# Altium schematic sheet IO_ANALOG_DIGITAL.SchDoc
size A3; SheetNumber: 12; SheetTotal: 14
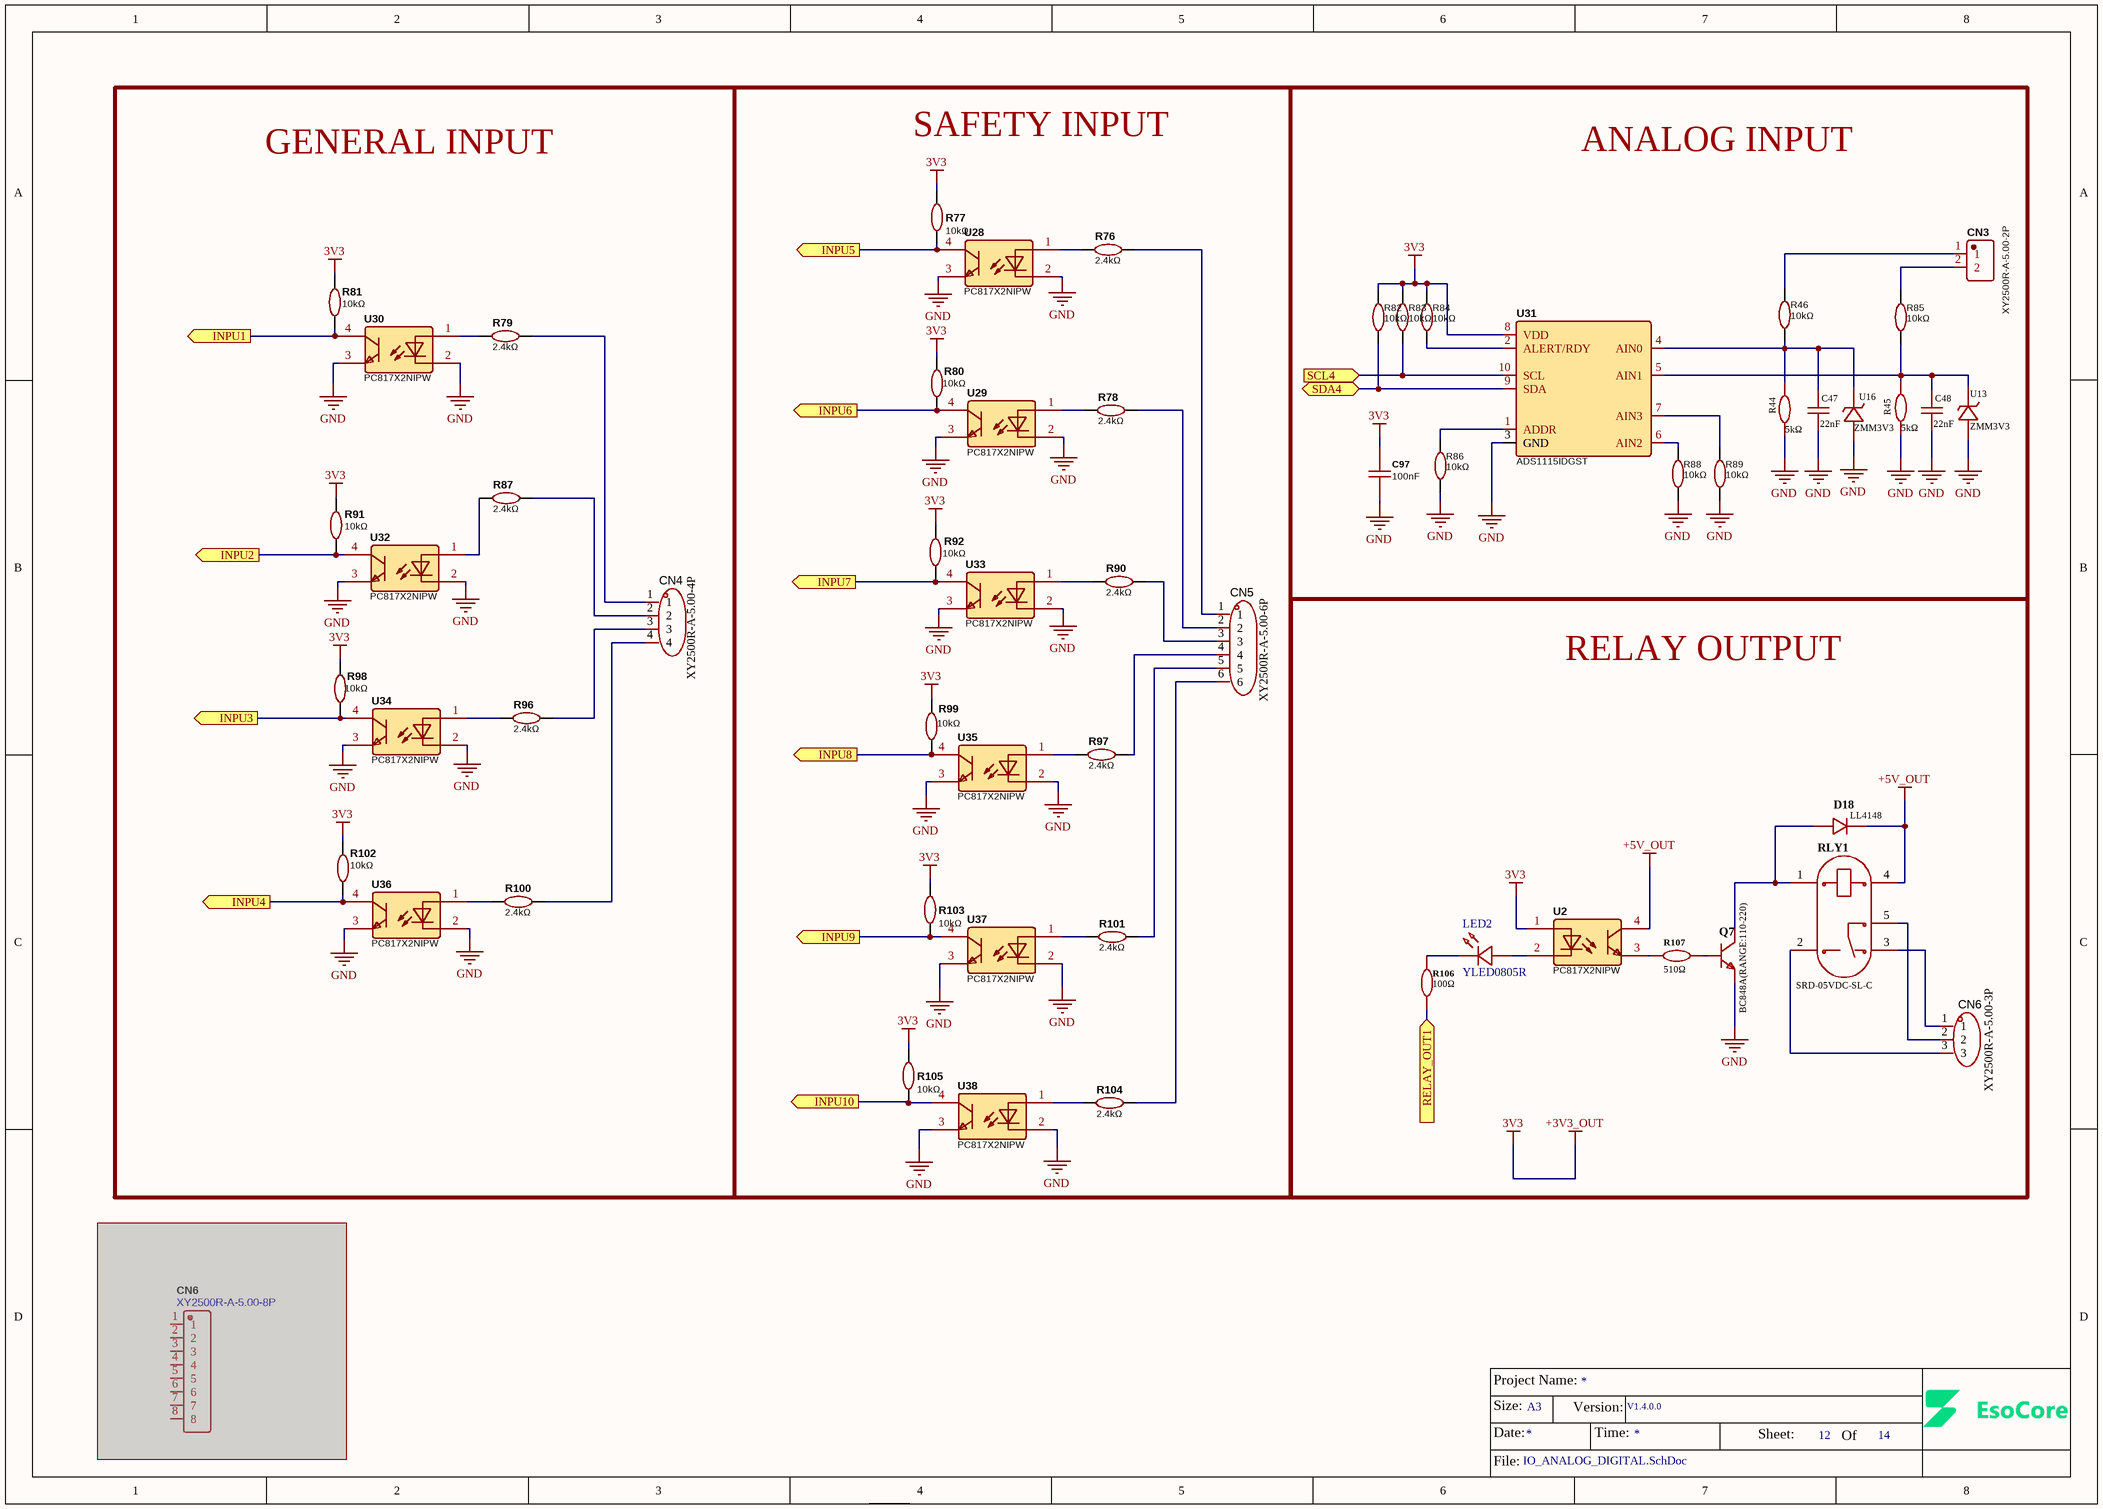
[diagram p0: IO_ANALOG_DIGITAL.SchDoc]

## Parts
(Parts that share a designator on the sheet are numbered #1, #2 ... from top to bottom, then left to right.)
C47  22nF  [C_0603]
C48  22nF  [C_0603]
C97  100nF  [C_0805]
CN3  XY2500R-A-5.00-2P  [CONN-TH_XY2500R-A-5.00-2P]
CN4  XY2500R-A-5.00-4P  [CONN-TH_XY2500R-A-5.00-4P]
CN5  XY2500R-A-5.00-6P  [CONN-TH_XY2500R-A-5.00-6P]
CN6#1  XY2500R-A-5.00-3P  [CONN-TH_XY2500R-A-5.00-3P]
CN6#2  XY2500R-A-5.00-8P  [CONN-TH_8P-P5.00_XY2500R-A-5.00-8P]  (masked out: inside a compile mask, not in the netlist)
D18  LL4148  [LL-34_L3.5-W1.5-RD]
LED2  YLED0805R  [LED0805-RD_RED]
Q7  BC848A(RANGE:110-220)  [SOT-23-3_L2.9-W1.6-P1.90-LS2.8-BR]
R44  5kΩ  [R_0603]
R45  5kΩ  [R_0603]
R46  10kΩ  [R_0603]
R76  2.4kΩ  [R_0603]
R77  10kΩ  [R_0805]
R78  2.4kΩ  [R_0603]
R79  2.4kΩ  [R_0603]
R80  10kΩ  [R_0805]
R81  10kΩ  [R_0805]
R82  10kΩ  [R_0603]
R83  10kΩ  [R_0603]
R84  10kΩ  [R_0603]
R85  10kΩ  [R_0603]
R86  10kΩ  [R_0603]
R87  2.4kΩ  [R_0603]
R88  10kΩ  [R_0603]
R89  10kΩ  [R_0603]
R90  2.4kΩ  [R_0603]
R91  10kΩ  [R_0805]
R92  10kΩ  [R_0805]
R96  2.4kΩ  [R_0603]
R97  2.4kΩ  [R_0603]
R98  10kΩ  [R_0805]
R99  10kΩ  [R_0805]
R100  2.4kΩ  [R_0603]
R101  2.4kΩ  [R_0603]
R102  10kΩ  [R_0805]
R103  10kΩ  [R_0805]
R104  2.4kΩ  [R_0603]
R105  10kΩ  [R_0805]
R106  100Ω  [R_0805]
R107  510Ω  [R_0805]
RLY1  SRD-05VDC-SL-C  [RELAY-TH_SRD-XXVDC-XL-C]
U2  PC817X2NIPW  [SOP-4_L6.5-W4.6-P2.54-LS10.0]
U13  ZMM3V3  [LL-34_L3.5-W1.5-RD]
U16  ZMM3V3  [LL-34_L3.5-W1.5-RD]
U28  PC817X2NIPW  [SOP-4_L6.5-W4.6-P2.54-LS10.0]
U29  PC817X2NIPW  [SOP-4_L6.5-W4.6-P2.54-LS10.0]
U30  PC817X2NIPW  [SOP-4_L6.5-W4.6-P2.54-LS10.0]
U31  ADS1115IDGST  [VSSOP-10_L3.0-W3.0-P0.50-LS4.9-BL]
U32  PC817X2NIPW  [SOP-4_L6.5-W4.6-P2.54-LS10.0]
U33  PC817X2NIPW  [SOP-4_L6.5-W4.6-P2.54-LS10.0]
U34  PC817X2NIPW  [SOP-4_L6.5-W4.6-P2.54-LS10.0]
U35  PC817X2NIPW  [SOP-4_L6.5-W4.6-P2.54-LS10.0]
U36  PC817X2NIPW  [SOP-4_L6.5-W4.6-P2.54-LS10.0]
U37  PC817X2NIPW  [SOP-4_L6.5-W4.6-P2.54-LS10.0]
U38  PC817X2NIPW  [SOP-4_L6.5-W4.6-P2.54-LS10.0]

## Blocks framed on the sheet
SAFETY INPUT: CN5 R76-R78 R80 R90 R92 R97 R99 R101 R103-R105 U28 U29 U33 U35 U37 U38
RELAY OUTPUT: CN6#1 D18 LED2 Q7 R106 R107 RLY1 U2

## Ports
INPU1 (out), INPU2 (out), INPU3 (out), INPU4 (out), INPU5 (out), INPU6 (out), INPU7 (out), INPU8 (out), INPU9 (out), INPU10 (out), RELAY_OUT1 (in), SCL4 (in), SDA4 (bidir)

## Nets
+3V3_OUT: C97.2 R77.2 R80.2 R81.2 R82.2 R83.2 R84.2 R91.2 R92.2 R98.2 R99.2 R102.2 R103.2 R105.2 U2.1(A) U31.8(VDD)  [also labelled 3V3]
+5V_OUT: D18.1(K) RLY1.4 U2.4(C)
GND: C47.1 C48.1 C97.1 Q7.2(E) R44.1 R45.1 R86.1 R88.1 R89.1 U13.2(A) U16.2(A) U28.2(C) U28.3(E) U29.2(C) U29.3(E) U30.2(C) U30.3(E) U31.3(GND) U32.2(C) U32.3(E) U33.2(C) U33.3(E) U34.2(C) U34.3(E) U35.2(C) U35.3(E) U36.2(C) U36.3(E) U37.2(C) U37.3(E) U38.2(C) U38.3(E)
INPU1: R81.1 U30.4(C) ; port INPU1
INPU2: R91.1 U32.4(C) ; port INPU2
INPU3: R98.1 U34.4(C) ; port INPU3
INPU4: R102.1 U36.4(C) ; port INPU4
INPU5: R77.1 U28.4(C) ; port INPU5
INPU6: R80.1 U29.4(C) ; port INPU6
INPU7: R92.1 U33.4(C) ; port INPU7
INPU8: R99.1 U35.4(C) ; port INPU8
INPU9: R103.1 U37.4(C) ; port INPU9
INPU10: R105.1 U38.4(C) ; port INPU10
RELAY_OUT1: R106.1 ; port RELAY_OUT1
SCL4: R83.1 U31.10(SCL) ; port SCL4
SDA4: R82.1 U31.9(SDA) ; port SDA4
NetC47_2: C47.2 R44.2 R46.1 U16.1(C) U31.4(AIN0)
NetC48_2: C48.2 R45.2 R85.1 U13.1(C) U31.5(AIN1)
NetCN3_1: CN3.1 R46.2
NetCN3_2: CN3.2 R85.2
NetCN4_1: CN4.1 R79.2
NetCN4_2: CN4.2 R87.2
NetCN4_3: CN4.3 R96.2
NetCN4_4: CN4.4 R100.2
NetCN5_1: CN5.1 R76.2
NetCN5_2: CN5.2 R78.2
NetCN5_3: CN5.3 R90.2
NetCN5_4: CN5.4 R97.2
NetCN5_5: CN5.5 R101.2
NetCN5_6: CN5.6 R104.2
NetCN6#1_1: CN6#1.1 RLY1.3
NetCN6#1_2: CN6#1.2 RLY1.5
NetCN6#1_3: CN6#1.3 RLY1.2
NetD18_2: D18.2(A) Q7.3(C) RLY1.1
NetLED2_1: LED2.1(K) R106.2
NetLED2_2: LED2.2(A) U2.2(C)
NetQ7_1: Q7.1(B) R107.2
NetR76_1: R76.1 U28.1(A)
NetR78_1: R78.1 U29.1(A)
NetR79_1: R79.1 U30.1(A)
NetR84_1: R84.1 U31.2(ALERT/RDY)
NetR86_2: R86.2 U31.1(ADDR)
NetR87_1: R87.1 U32.1(A)
NetR88_2: R88.2 U31.6(AIN2)
NetR89_2: R89.2 U31.7(AIN3)
NetR90_1: R90.1 U33.1(A)
NetR96_1: R96.1 U34.1(A)
NetR97_1: R97.1 U35.1(A)
NetR100_1: R100.1 U36.1(A)
NetR101_1: R101.1 U37.1(A)
NetR104_1: R104.1 U38.1(A)
NetR107_1: R107.1 U2.3(E)

## Notes on the sheet
- GENERAL INPUT
- ANALOG INPUT
- Project Name:
- Size:
- Date:
- A3
- Version:
- Time:
- V1.4.0.0
- Sheet:
- Of
- File:

## Library data of the parts
C47 C48 = CL10B223KB8NNNC: Manufacturer: SAMSUNG(三星); Add into BOM: yes; Tolerance: ±10%; Voltage Rating: 50V; Temperature Coefficient: X7R; Symbol: CL10B223KB8NNNC; Device: CL10B223KB8NNNC; Supplier: LCSC; Manufacturer Part: CL10B223KB8NNNC; Value: 22nF; Supplier Part: C21122; JLCPCB Part Class: Basic Part; LCSC Part Name: 22nF ±10% 50V; Supplier Footprint: 0603; Datasheet: https://item.szlcsc.com/datasheet/CL10B223KB8NNNC/21834.html; Convert to PCB: yes
C97 = 100nF: Manufacturer Part: CC0805KRX7R9BB104; Manufacturer: YAGEO(国巨); nameAlias: Value; Supplier: LCSC; Supplier Part: C49678; JLCPCB Part Class: Basic Part; spicePre: C; spiceSymbolName: CC0805KRX7R9BB104
CN3 = XY2500R-A-5.00-2P: Manufacturer: XINLAIYA(新莱亚); Contributor: LCSC; Supplier: LCSC; Supplier Part: C505797; Manufacturer Part: XY2500R-A-5.00-2P; JLCPCB Part Class: Extended Part; spicePre: C; spiceSymbolName: XY2500R-A-5.00-2P
CN4 = XY2500R-A-5.00-4P: Manufacturer: XINLAIYA(新莱亚); Add into BOM: yes; Connector Type: Board Side/Socket - Open; Number of Positions or Pins: 1x4P; Pitch: 5mm; Number of PINs Per Row: 4; Current Rating: 15A; Voltage Rating (Max): 300V; Symbol: XY2500R-A-5.00-4P; Device: XY2500R-A-5.00-4P; LCSC Part Name: 1x4P 5mm 排数:1 每排P数:4; Supplier Part: C505799; Manufacturer Part: XY2500R-A-5.00-4P; Supplier Footprint: 弯插,P=5mm; JLCPCB Part Class: Extended Part; Datasheet: https://item.szlcsc.com/datasheet/XY2500R-A-5.00-4P/519089.html; Supplier: LCSC; Convert to PCB: yes; Color: Green; Mounting Type: Right-Angle Pin; Number of Pins: 4P; Number of Rows: 1
CN5 = XY2500R-A-5.00-6P: Manufacturer: XINLAIYA(新莱亚); Add into BOM: yes; Connector Type: Board Side/Socket - Open; Number of Positions or Pins: 1x6P; Pitch: 5mm; Number of PINs Per Row: 6; Current Rating: 15A; Voltage Rating (Max): 300V; Symbol: XY2500R-A-5.00-6P; Device: XY2500R-A-5.00-6P; LCSC Part Name: 1x6P 5mm 排数:1 每排P数:6; Supplier Part: C505801; Manufacturer Part: XY2500R-A-5.00-6P; Supplier Footprint: 弯插,P=5mm; JLCPCB Part Class: Extended Part; Datasheet: https://item.szlcsc.com/datasheet/XY2500R-A-5.00-6P/519091.html; Supplier: LCSC; Convert to PCB: yes; Color: Green; Mounting Type: Right-Angle Pin; Number of Pins: 6P; Number of Rows: 1
CN6#1 = XY2500R-A-5.00-3P: Manufacturer: XINLAIYA(新莱亚); Add into BOM: yes; Connector Type: Board Side/Socket - Open; Number of Positions or Pins: 1x3P; Pitch: 5mm; Number of PINs Per Row: 3; Current Rating: 15A; Voltage Rating (Max): 300V; Symbol: XY2500R-A-5.00-3P; Device: XY2500R-A-5.00-3P; LCSC Part Name: 1x3P 5mm 排数:1 每排P数:3; Supplier Part: C505798; Manufacturer Part: XY2500R-A-5.00-3P; Supplier Footprint: 弯插,P=5mm; JLCPCB Part Class: Extended Part; Datasheet: https://item.szlcsc.com/datasheet/XY2500R-A-5.00-3P/519088.html; Supplier: LCSC; Convert to PCB: yes; Color: Green; Mounting Type: Right-Angle Pin; Number of Pins: 3P; Number of Rows: 1
CN6#2 = XY2500R-A-5.00-8P: Manufacturer: XINLAIYA(新莱亚); Contributor: LCSC; Supplier: LCSC; Supplier Part: C505803; Manufacturer Part: XY2500R-A-5.00-8P; JLCPCB Part Class: Extended Part; spicePre: C; spiceSymbolName: XY2500R-A-5.00-8P
D18 = LL4148_C9808: Manufacturer: ST(先科); Add into BOM: yes; Voltage - Forward(Vf@If): 1V@10mA; Voltage - DC Reverse(Vr): 75V; Current - Rectified: 200mA; Pd - Power Dissipation: 500mW; Reverse Leakage Current (Ir): 5uA@75V; Reverse Recovery Time (trr): 4ns; Symbol: LL4148; Device: LL4148_C9808; LCSC Part Name: 停产; Supplier Part: C9808; Manufacturer Part: LL4148; Supplier Footprint: LL-34; JLCPCB Part Class: Extended Part; Datasheet: https://item.szlcsc.com/datasheet/LL4148/10338.html; Supplier: LCSC; Convert to PCB: yes; Diode Configuration: -; Operating Junction Temperature Range: -
LED2 = YLED0805R: Manufacturer: YONGYUTAI(永裕泰); Add into BOM: yes; Emitted Color: Red; Forward Voltage (VF): 1.8V~2.4V; Power Dissipation: 60mW; Forward Current: 20mA; Dominant Wavelength: 615nm~630nm; Peak Wavelength: 645nm; Symbol: YLED0805R; Device: YLED0805R; LCSC Part Name: YLED0805R; Supplier Part: C19171391; Manufacturer Part: YLED0805R; Supplier Footprint: 0805; JLCPCB Part Class: Extended Part; Datasheet: https://atta.szlcsc.com/upload/public/pdf/source/20231027/AB486D22E6D71BC59190C48A798367E6.pdf; Supplier: LCSC; Convert to PCB: yes; Diode Configuration: -; Lens Color: -; Color Temperature: -; Luminous Intensity: -; Viewing Angle: -; Mounting Sytle: -; Operating Temperature: -40℃~+85℃
Q7 = BC848A(RANGE:110-220): Manufacturer: CJ(江苏长电/长晶); Add into BOM: yes; type: NPN; Current - Collector(Ic): 100mA; Collector - Emitter Voltage VCEO: 30V; Pd - Power Dissipation: 200mW; DC Current Gain: 110@2mA,5V; Transition frequency(fT): 100MHz; Current - Collector Cutoff: 100nA; Vce Saturation(VCE(sat)): 500mV; Symbol: BC848A; Device: BC848A(RANGE:110-220); LCSC Part Name: hfe=110~220 NPN 电流:0.1A 电压:30V; Supplier Part: C8576; Manufacturer Part: BC848A(RANGE:110-220); Supplier Footprint: SOT-23; JLCPCB Part Class: Extended Part; Datasheet: https://item.szlcsc.com/datasheet/BC848A(RANGE%253A110-220)/9071.html; Supplier: LCSC; Convert to PCB: yes; Operating Temperature: -55℃~+150℃
R44 R45 = RT0603BRE075KL: Manufacturer: YAGEO(国巨); Add into BOM: yes; Tolerance: ±0.1%; Temperature Coefficient: ±50ppm/℃; Symbol: RT0603BRE075KL; Device: RT0603BRE075KL; LCSC Part Name: 薄膜电阻 5kΩ ±0.1% 100mW; Supplier Part: C862232; Manufacturer Part: RT0603BRE075KL; Supplier Footprint: 0603; JLCPCB Part Class: Extended Part; Datasheet: https://atta.szlcsc.com/upload/public/pdf/source/20200610/C326738_5639A9F1B6EB6E4AE2197577D3456E7F.pdf; Supplier: LCSC; Convert to PCB: yes; Type: Thin Film Resistor; Value: 5kΩ; Operating Temperature Range: -55℃~+155℃
R46 R82-R86 R88 R89 = 10kΩ: Manufacturer: YAGEO(国巨); Manufacturer Part: RC0603FR-0710KL; nameAlias: Value; Supplier: LCSC; Supplier Part: C98220; JLCPCB Part Class: Extended Part; spicePre: R; spiceSymbolName: RC0603FR-0710KL
R76 R78 R79 R87 R90 R96 R97 R100 R101 R104 = 2.4kΩ: Manufacturer: YAGEO(国巨); Manufacturer Part: RC0603FR-072K4L; nameAlias: Value; Supplier: LCSC; Supplier Part: C114611; JLCPCB Part Class: Extended Part; spicePre: R; spiceSymbolName: RC0603FR-072K4L
R77 R80 R81 R91 R92 R98 R99 R102 R103 R105 = 10kΩ: Manufacturer: YAGEO(国巨); Manufacturer Part: RT0805BRD0710KL; nameAlias: Value; Supplier: LCSC; Supplier Part: C110775; JLCPCB Part Class: Extended Part; spicePre: R; spiceSymbolName: RT0805BRD0710KL
R106 = RC0805FR-07100RL: Manufacturer: YAGEO(国巨); Add into BOM: yes; Tolerance: ±1%; Power(Watts): 125mW; Voltage-Supply(Max): 150V; Temperature Coefficient: ±100ppm/℃; Symbol: RC0805FR-07100RL; Device: RC0805FR-07100RL; LCSC Part Name: 厚膜电阻 100Ω ±1% 125mW; Supplier Part: C105577; Manufacturer Part: RC0805FR-07100RL; Supplier Footprint: 0805; JLCPCB Part Class: Extended Part; Datasheet: https://item.szlcsc.com/datasheet/RC0805FR-07100RL/106792.html; Supplier: LCSC; Convert to PCB: yes; Type: Thick Film Resistor; Value: 100Ω; Operating Temperature: -55℃~+155℃
R107 = RC0805FR-07510RL: Manufacturer: YAGEO(国巨); Add into BOM: yes; Tolerance: ±1%; Temperature Coefficient: ±100ppm/℃; Symbol: RC0805FR-07510RL; Device: RC0805FR-07510RL; LCSC Part Name: 厚膜电阻 510Ω ±1% 125mW; Supplier Part: C114563; Manufacturer Part: RC0805FR-07510RL; Supplier Footprint: 0805; JLCPCB Part Class: Extended Part; Datasheet: https://atta.szlcsc.com/upload/public/pdf/source/20180821/C275644_0D56F95EFF785E7D9A1FEF436B37DA78.pdf; Supplier: LCSC; Convert to PCB: yes; Type: Thick Film Resistors; Value: 510Ω; Operating Temperature Range: -55℃~+155℃
RLY1 = SRD-05VDC-SL-C: Manufacturer: 松乐; Add into BOM: yes; Coil Voltage: 5V; Contact Form: 一组转换:1C(SPDT-转换); Pin Number: 5; Maximum Switching Voltage: 250V@AC; Coil Rated Power: 360mW; Maximum Switching Current: 15A; Coil Type: 无极性-单线圈; Coil Resistance: 70Ω; Contact Resistance: 100mΩ; Operate Time: 10ms; Symbol: SRD-05VDC-SL-C; Device: SRD-05VDC-SL-C; LCSC Part Name: 蓝色; Supplier Part: C35449; Manufacturer Part: SRD-05VDC-SL-C; Supplier Footprint: 插件,15.6x19.2mm; JLCPCB Part Class: Extended Part; Datasheet: https://atta.szlcsc.com/upload/public/pdf/source/20200305/C490149_C96E4098A3B1FFB377D5AD2E40B7C2A8.pdf; Supplier: LCSC; Convert to PCB: yes; Contact Rating: -; Release Time: 10ms
U2 U28-U30 U32-U38 = PC817X2NIPW: Manufacturer: SHARP(夏普); Contributor: LCSC; Supplier: LCSC; Supplier Part: C2840443; Manufacturer Part: PC817X2NIPW; JLCPCB Part Class: Extended Part; spicePre: U; spiceSymbolName: PC817X2NIPW
U13 U16 = ZMM3V3_C5345987: Manufacturer: HXY MOSFET(华轩阳电子); Add into BOM: yes; Diode Configuration: Independent; Zener Voltage(Nom): 3.3V; Reverse Leakage Current (Ir): 2uA; Zener Voltage(Range): 3.1V~3.5V; Pd - Power Dissipation: 500mW; Impedance(Zzt): 85Ω; Impedance(Zzk): 600Ω; Symbol: ZMM3V3_C5345987; Device: ZMM3V3_C5345987; LCSC Part Name: 独立式 耐压:3.3V 电流:2uA; Supplier Part: C5345987; Manufacturer Part: ZMM3V3; Supplier Footprint: LL-34; JLCPCB Part Class: Extended Part; Datasheet: https://item.szlcsc.com/datasheet/ZMM3V3/6125824.html; Supplier: LCSC; Convert to PCB: yes
U31 = ADS1115IDGST: Manufacturer: TI(德州仪器); Contributor: LCSC; Supplier: LCSC; Supplier Part: C468683; Manufacturer Part: ADS1115IDGST; JLCPCB Part Class: Extended Part; spicePre: U; spiceSymbolName: ADS1115IDGST